# EAGLE design Bipolar Matrix Mixer 4x2 v5 (EAGLE 6.0)
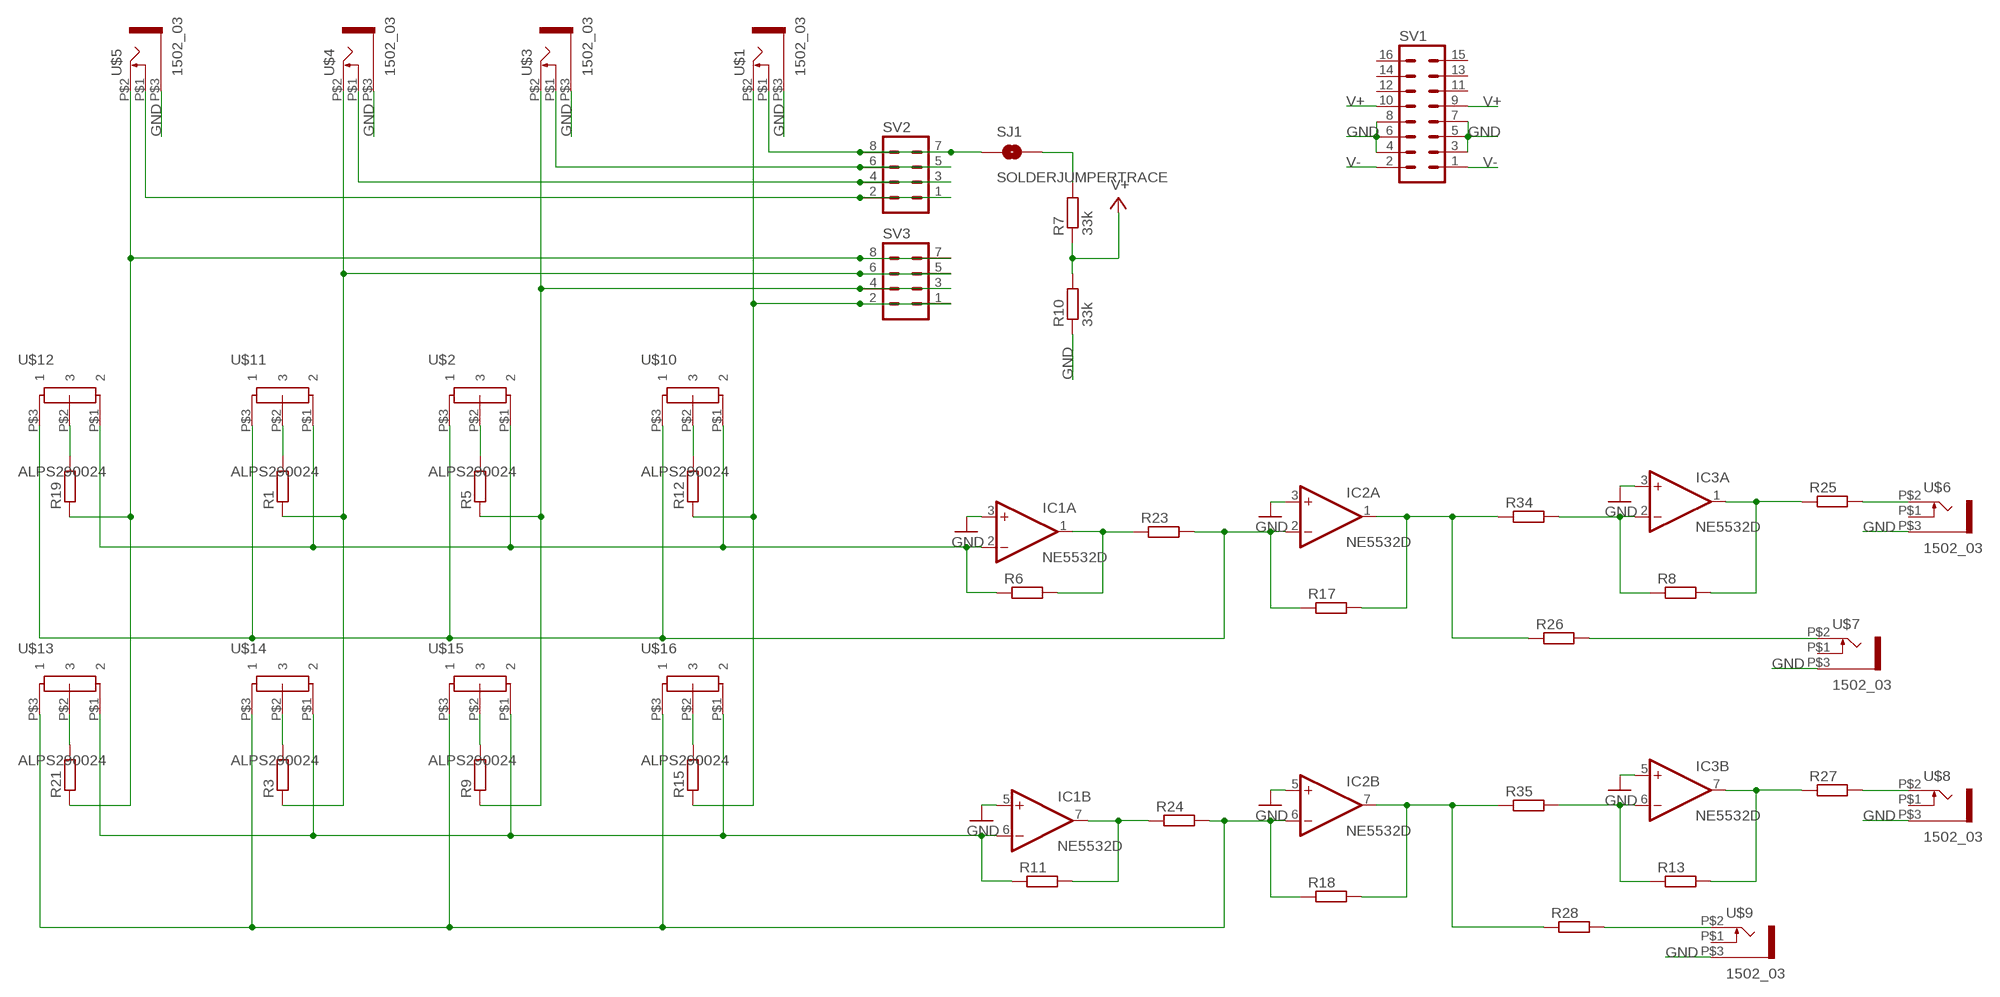
[diagram p0: schematic, sheet 1]

## Parts
IC1  NE5532D  [SO08]
IC2  NE5532D  [SO08]
IC3  NE5532D  [SO08]
R1  R-EU_R0603  [R0603]
R3  R-EU_R0603  [R0603]
R5  R-EU_R0603  [R0603]
R6  R-EU_R0603  [R0603]
R7  33k  R-EU_R0603  [R0603]
R8  R-EU_R0603  [R0603]
R9  R-EU_R0603  [R0603]
R10  33k  R-EU_R0603  [R0603]
R11  R-EU_R0603  [R0603]
R12  R-EU_R0603  [R0603]
R13  R-EU_R0603  [R0603]
R15  R-EU_R0603  [R0603]
R17  R-EU_R0603  [R0603]
R18  R-EU_R0603  [R0603]
R19  R-EU_R0603  [R0603]
R21  R-EU_R0603  [R0603]
R23  R-EU_R0603  [R0603]
R24  R-EU_R0603  [R0603]
R25  R-EU_R0603  [R0603]
R26  R-EU_R0603  [R0603]
R27  R-EU_R0603  [R0603]
R28  R-EU_R0603  [R0603]
R34  R-EU_R0603  [R0603]
R35  R-EU_R0603  [R0603]
SJ1  SOLDERJUMPERTRACE  [SJ_2S-TRACE]
SV1  MA08-2  [MA08-2]
SV2  MA04-2  [MA04-2]
SV3  MA04-2  [MA04-2]
U$1  1502_03  [1502_03]
U$2  ALPS290024  [POT]
U$3  1502_03  [1502_03]
U$4  1502_03  [1502_03]
U$5  1502_03  [1502_03]
U$6  1502_03  [1502_03]
U$7  1502_03  [1502_03]
U$8  1502_03  [1502_03]
U$9  1502_03  [1502_03]
U$10  ALPS290024  [POT]
U$11  ALPS290024  [POT]
U$12  ALPS290024  [POT]
U$13  ALPS290024  [POT]
U$14  ALPS290024  [POT]
U$15  ALPS290024  [POT]
U$16  ALPS290024  [POT]

## Nets
GND: IC1.3(A:+IN) IC1.5(B:+IN) IC2.3(A:+IN) IC2.5(B:+IN) IC3.3(A:+IN) IC3.5(B:+IN) R10.1 SV1.3 SV1.4 SV1.5 SV1.6 SV1.7 SV1.8 U$1.P$3 U$3.P$3 U$4.P$3 U$5.P$3 U$6.P$3 U$7.P$3 U$8.P$3 U$9.P$3
N$1: IC2.1(A:OUT) R17.2 R26.1 R34.1
N$2: R1.1 R3.1 SV3.5 SV3.6 U$4.P$2
N$3: IC1.7(B:OUT) R11.2 R24.1
N$4: IC1.1(A:OUT) R6.2 R23.1
N$5: IC3.7(B:OUT) R13.2 R27.1
N$6: IC3.1(A:OUT) R8.2 R25.1
N$7: R19.2 U$12.P$2
N$8: R21.2 U$13.P$2
N$9: R25.2 U$6.P$2
N$10: R7.2 SJ1.2
N$11: R26.2 U$7.P$2
N$12: R1.2 U$11.P$2
N$13: R3.2 U$14.P$2
N$14: IC2.7(B:OUT) R18.2 R28.1 R35.1
N$15: R27.2 U$8.P$2
N$16: IC2.2(A:-IN) R17.1 R23.2 U$2.P$3 U$10.P$3 U$11.P$3 U$12.P$3
N$17: R28.2 U$9.P$2
N$18: IC3.2(A:-IN) R8.1 R34.2
N$19: R5.1 R9.1 SV3.3 SV3.4 U$3.P$2
N$20: SV2.5 SV2.6 U$3.P$1
N$21: R5.2 U$2.P$2
N$22: R9.2 U$15.P$2
N$23: IC3.6(B:-IN) R13.1 R35.2
N$24: IC1.2(A:-IN) R6.1 U$2.P$1 U$10.P$1 U$11.P$1 U$12.P$1
N$25: R12.1 R15.1 SV3.1 SV3.2 U$1.P$2
N$26: R19.1 R21.1 SV3.7 SV3.8 U$5.P$2
N$27: IC2.6(B:-IN) R18.1 R24.2 U$13.P$3 U$14.P$3 U$15.P$3 U$16.P$3
N$28: IC1.6(B:-IN) R11.1 U$13.P$1 U$14.P$1 U$15.P$1 U$16.P$1
N$29: SJ1.1 SV2.7 SV2.8 U$1.P$1
N$30: SV2.3 SV2.4 U$4.P$1
N$31: SV2.1 SV2.2 U$5.P$1
N$45: R12.2 U$10.P$2
N$46: R15.2 U$16.P$2
V+: R7.1 R10.2 SV1.9 SV1.10
V-: SV1.1 SV1.2
Unconnected: SV1.11 SV1.12 SV1.13 SV1.14 SV1.15 SV1.16 U$6.P$1 U$7.P$1 U$8.P$1 U$9.P$1

## Power pins joined to a net without a drawn wire
V+: IC1.8(P:V+) IC2.8(P:V+) IC3.8(P:V+)
V-: IC1.4(P:V-) IC2.4(P:V-) IC3.4(P:V-)

## Library data of the parts
IC1-IC3 = linear:NE5532: AUDIO AMPLIFIER
R1 R3 R5-R13 R15 R17-R19 R21 R23-R28 R34 R35 = resistor:R-EU_: RESISTOR, European symbol
SJ1 = SparkFun:SOLDERJUMPER: Solder Jumper Standard SMD solder jumper. Used to automate production. Two varients : Normally Open and Normally Closed are the same, but have different paste layers. NC will have a large amount of paste and should jumper during reflow.
SV1 = con-lstb:MA08-2: PIN HEADER; OC_FARNELL: unknown; OC_NEWARK: unknown
SV2 SV3 = con-lstb:MA04-2: PIN HEADER; OC_FARNELL: unknown; OC_NEWARK: unknown
U$1 U$3-U$9 = con-lumberg:1502_03
U$2 U$10-U$16 = pot-alps:ALPS290024

## Board
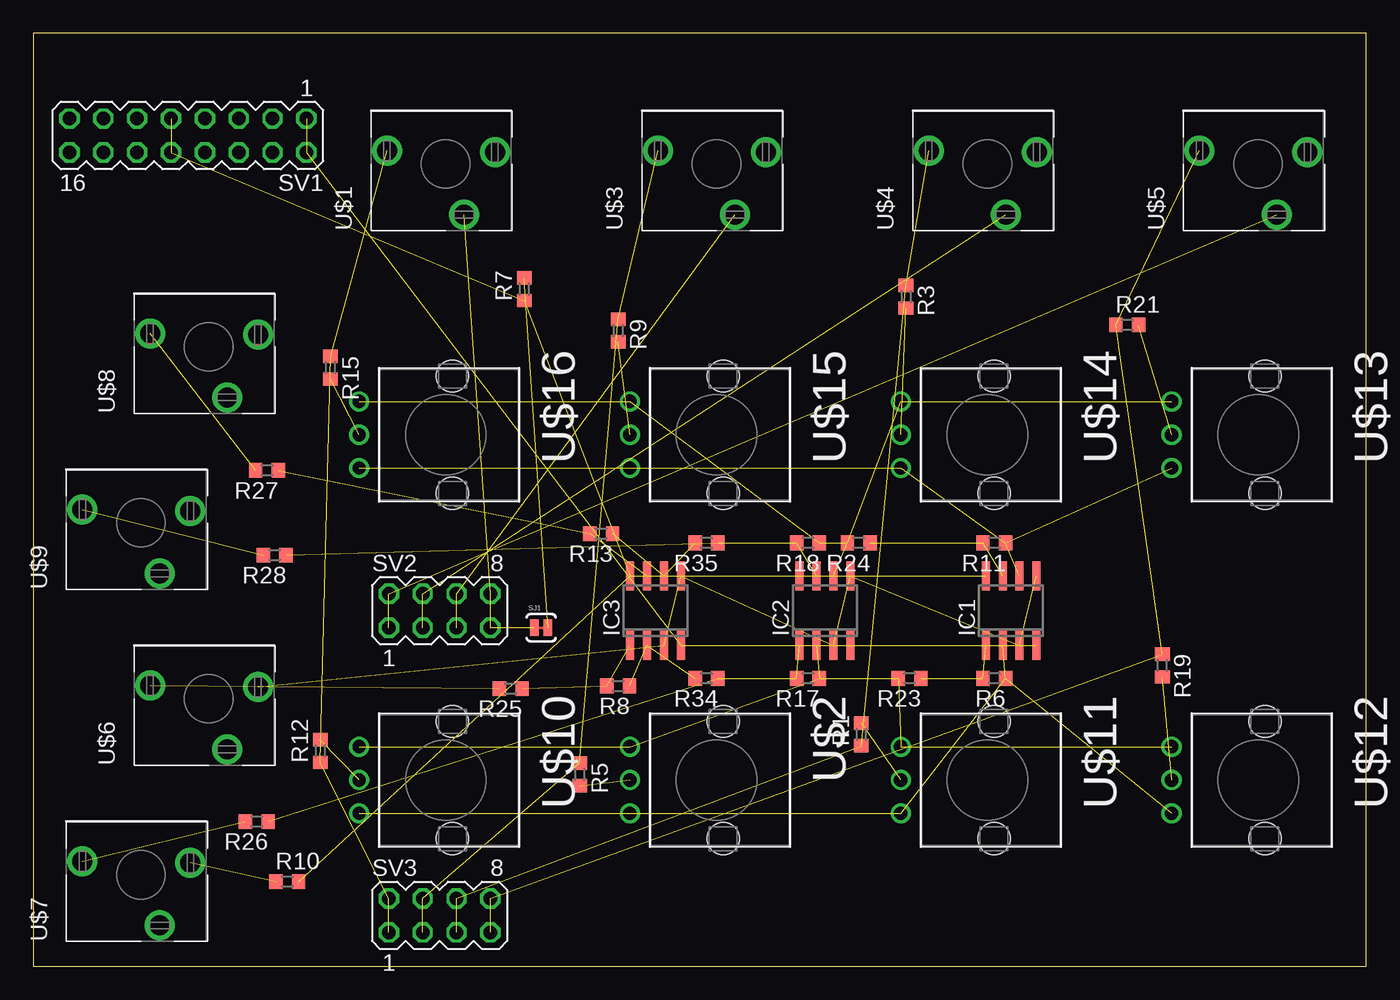
[diagram p1: board, top side]
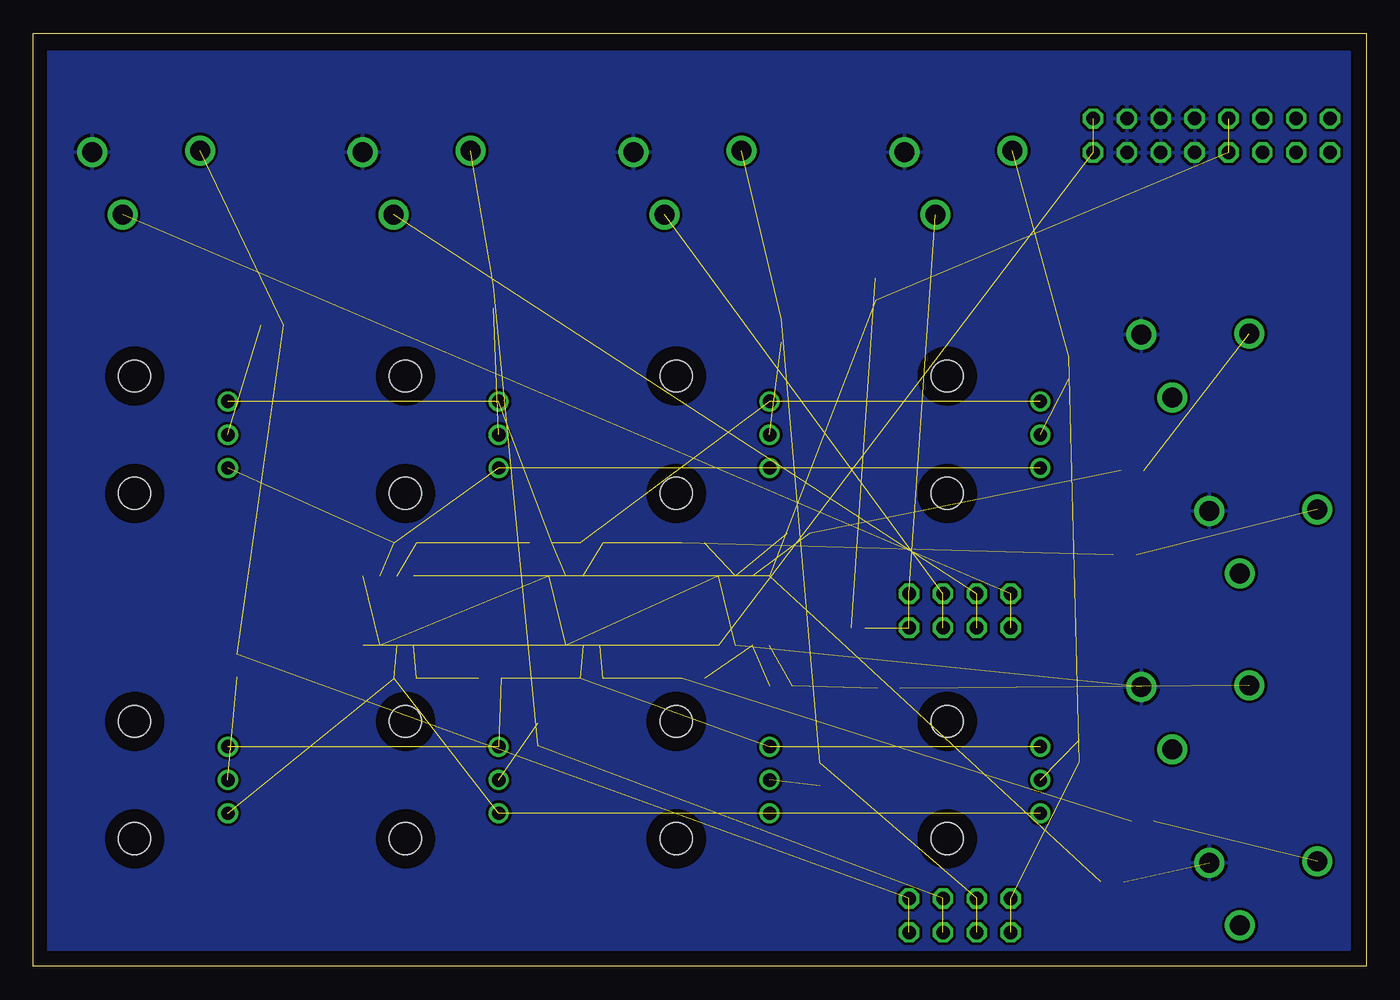
[diagram p2: board, bottom side, seen from below]

Size 100 x 70 mm. Coordinates in mm from the lower left corner, seen from the top.
Outline: 0,0 100,0 100,70 0,70 0,0
Copper layers (1*16): Top 0.035mm / dielectric 1.5mm / Bottom 0.035mm
Design rules: minimum track width 10mil, minimum drill 24mil, track to track 8mil, track to pad 8mil, pad to pad 8mil, via to via 8mil, smd to smd 8mil, copper to edge 40mil, drill to drill 8mil, minimum pad ring 10mil, minimum via ring 8mil, stop-mask expansion 4mil, vias tented up to drill 0mil, thermal gap 10mil

### Footprints (pad centres in the part's own frame; a part is rotated, then mirrored left to right if it is on the bottom)
SO08 = smd 0.6 x 2.2: 1 -1.905,-2.6; 2 -0.635,-2.6; 3 0.635,-2.6; 4 1.905,-2.6; 5 1.905,2.6; 6 0.635,2.6; 7 -0.635,2.6; 8 -1.905,2.6
R0603 = smd 1 x 1.1: 1 -0.85,0; 2 0.85,0
SJ_2S-TRACE = smd 0.635 x 1.27: 1 -0.508,0; 2 0.508,0
MA08-2 = drill 1.016 octagon: 1 -8.89,-1.27; 2 -8.89,1.27; 3 -6.35,-1.27; 4 -6.35,1.27; 5 -3.81,-1.27; 6 -3.81,1.27; 7 -1.27,-1.27; 8 -1.27,1.27; 9 1.27,-1.27; 10 1.27,1.27; 11 3.81,-1.27; 12 3.81,1.27; 13 6.35,-1.27; 14 6.35,1.27; 15 8.89,-1.27; 16 8.89,1.27
MA04-2 = drill 1.016 octagon: 1 -3.81,-1.27; 2 -3.81,1.27; 3 -1.27,-1.27; 4 -1.27,1.27; 5 1.27,-1.27; 6 1.27,1.27; 7 3.81,-1.27; 8 3.81,1.27
1502_03 = drill 1.5: P$1 -3.8,-1.4; P$2 1,4.4; P$3 0.9,-3.7
POT = drill 1: P$1 2.5,-3.5; P$2 0,-3.5; P$3 -2.5,-3.5 | hole 2.4: -4.4,3.5; 4.4,3.5

### Placement (x,y rotation side)
IC1  73.36,26.68 0 top
IC2  59.39,26.68 0 top
IC3  46.69,26.68 0 top
R1  62.12,17.4 90 top
R3  65.47,50.23 270 top
R5  40.99,14.4 270 top
R6  72.09,21.6 180 top
R7  36.83,50.8 90 top
R8  43.88,21.03 180 top
R9  43.88,47.69 270 top
R10  19.05,6.35 0 top
R11  72.09,31.76 180 top
R12  21.53,16.15 90 top
R13  42.61,32.46 180 top
R15  22.29,44.91 270 top
R17  58.12,21.6 180 top
R18  58.12,31.76 180 top
R19  84.7,22.56 270 top
R21  82.07,48.12 0 top
R23  65.74,21.6 180 top
R24  61.93,31.76 180 top
R25  35.81,20.83 180 top
R26  16.76,10.86 180 top
R27  17.53,37.2 180 top
R28  18.11,30.85 180 top
R34  50.5,21.6 180 top
R35  50.5,31.76 180 top
SJ1  38.1,25.4 0 top
SV1  11.6,62.33 180 top
SV2  30.48,26.67 0 top
SV3  30.48,3.81 0 top
U$1  30.94,60.2 90 top
U$2  48.26,13.97 270 top
U$3  51.26,60.2 90 top
U$4  71.58,60.2 90 top
U$5  91.9,60.2 90 top
U$6  13.16,20.07 90 top
U$7  8.08,6.86 90 top
U$8  13.16,46.48 90 top
U$9  8.08,33.27 90 top
U$10  27.94,13.97 270 top
U$11  68.58,13.97 270 top
U$12  88.9,13.97 270 top
U$13  88.9,39.88 270 top
U$14  68.58,39.88 270 top
U$15  48.26,39.88 270 top
U$16  27.94,39.88 270 top

### Tracks (layer width: path | path; a pad name or v marks a point on that pad's centre or on a via)
GND  (7 unrouted)
  pour Bottom: 1.27,68.58 1.27,1.27 99.06,1.27 99.06,68.58
N$1  (3 unrouted)
N$2  (4 unrouted)
N$3  (2 unrouted)
N$4  (2 unrouted)
N$5  (2 unrouted)
N$6  (2 unrouted)
N$7  (1 unrouted)
N$8  (1 unrouted)
N$9  (1 unrouted)
N$10  (1 unrouted)
N$11  (1 unrouted)
N$12  (1 unrouted)
N$13  (1 unrouted)
N$14  (3 unrouted)
N$15  (1 unrouted)
N$16  (6 unrouted)
N$17  (1 unrouted)
N$18  (2 unrouted)
N$19  (4 unrouted)
N$20  (2 unrouted)
N$21  (1 unrouted)
N$22  (1 unrouted)
N$23  (2 unrouted)
N$24  (5 unrouted)
N$25  (4 unrouted)
N$26  (4 unrouted)
N$27  (6 unrouted)
N$28  (5 unrouted)
N$29  (3 unrouted)
N$30  (2 unrouted)
N$31  (2 unrouted)
N$45  (1 unrouted)
N$46  (1 unrouted)
V+  (6 unrouted)
V-  (4 unrouted)